# EAGLE schematic motorreference (EAGLE 6.3)
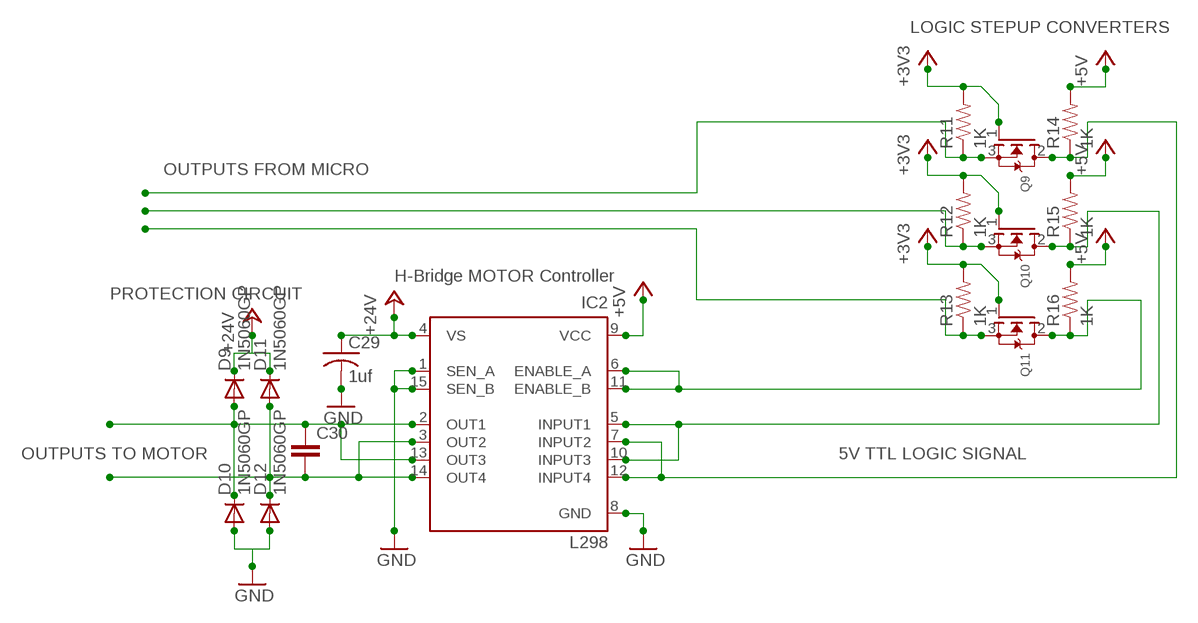
[diagram p0: schematic, sheet 1]

## Parts
C29  1uf  C-US025-050X050  [C025-050X050]
C30  C-EU025-024X044  [C025-024X044]
D9  1N5060GP  [DO15-12]
D10  1N5060GP  [DO15-12]
D11  1N5060GP  [DO15-12]
D12  1N5060GP  [DO15-12]
IC2  L298  [MULTIWATT-15]
Q9  MOSFET-NGDS_TO220V  [TO220V]
Q10  MOSFET-NGDS_TO220V  [TO220V]
Q11  MOSFET-NGDS_TO220V  [TO220V]
R11  1K  RESISTORAXIAL-0.3  [AXIAL-0.3]
R12  1K  RESISTORAXIAL-0.3  [AXIAL-0.3]
R13  1K  RESISTORAXIAL-0.3  [AXIAL-0.3]
R14  1K  RESISTORAXIAL-0.3  [AXIAL-0.3]
R15  1K  RESISTORAXIAL-0.3  [AXIAL-0.3]
R16  1K  RESISTORAXIAL-0.3  [AXIAL-0.3]

## Nets
+3V3: Q9.1(G) Q10.1(G) Q11.1(G) R11.P$2 R12.P$2 R13.P$2
+5V: IC2.9(VCC) R14.P$2 R15.P$2 R16.P$2
+24V: C29.1 D9.C D11.C IC2.4(VS)
DIGITALBUS8: Q10.3(S) R12.P$1
DIGITALBUS9: Q11.3(S) R13.P$1
DIGITALBUS11: Q9.3(S) R11.P$1
GND: C29.2 D10.A D12.A IC2.1(SEN_A) IC2.8(GND) IC2.15(SEN_B)
N$7: C30.2 D11.A D12.C IC2.3(OUT2) IC2.14(OUT4)
N$18: IC2.7(INPUT2) IC2.12(INPUT4) Q9.2(D) R14.P$1
N$28: C30.1 D9.A D10.C IC2.2(OUT1) IC2.13(OUT3)
N$30: IC2.6(ENABLE_A) IC2.11(ENABLE_B) Q11.2(D) R16.P$1
N$31: IC2.5(INPUT1) IC2.10(INPUT3)
N$43: Q10.2(D) R15.P$1

## Notes on the sheet
- LOGIC STEPUP CONVERTERS
- OUTPUTS FROM MICRO
- H-Bridge MOTOR Controller
- PROTECTION CIRCUIT
- OUTPUTS TO MOTOR | 5V TTL LOGIC SIGNAL

## Library data of the parts
C29 = adafruit:C-US: CAPACITOR, American symbol
C30 = rcl:C-EU: CAPACITOR, European symbol
D9-D12 = diode:1N5060GP: DIODE controlled avalanche rectifier
IC2 = st-microelectronics:L298: DUAL FULL-BRIDGE DRIVER; MPN: L298N; OC_FARNELL: 1589425; OC_NEWARK: 32M1527
Q9-Q11 = adafruit:MOSFET-N: N-Channel Mosfet 2N7002E - 60V 260mA SOT23 [Digikey: 2N7002ET1GOSTR-ND] - REEL BSH103 - 30V 850mA SOT23 [Digikey: 568-5013-1-ND]
R11-R16 = SparkFun:RESISTOR: Resistor Basic schematic elements and footprints for 0603, 1206, and PTH resistors.

## Net classes
0 Signal: width 0.508 mm